# EAGLE design Mini-MLL_Plus_v0.3 (EAGLE 9.6.2)
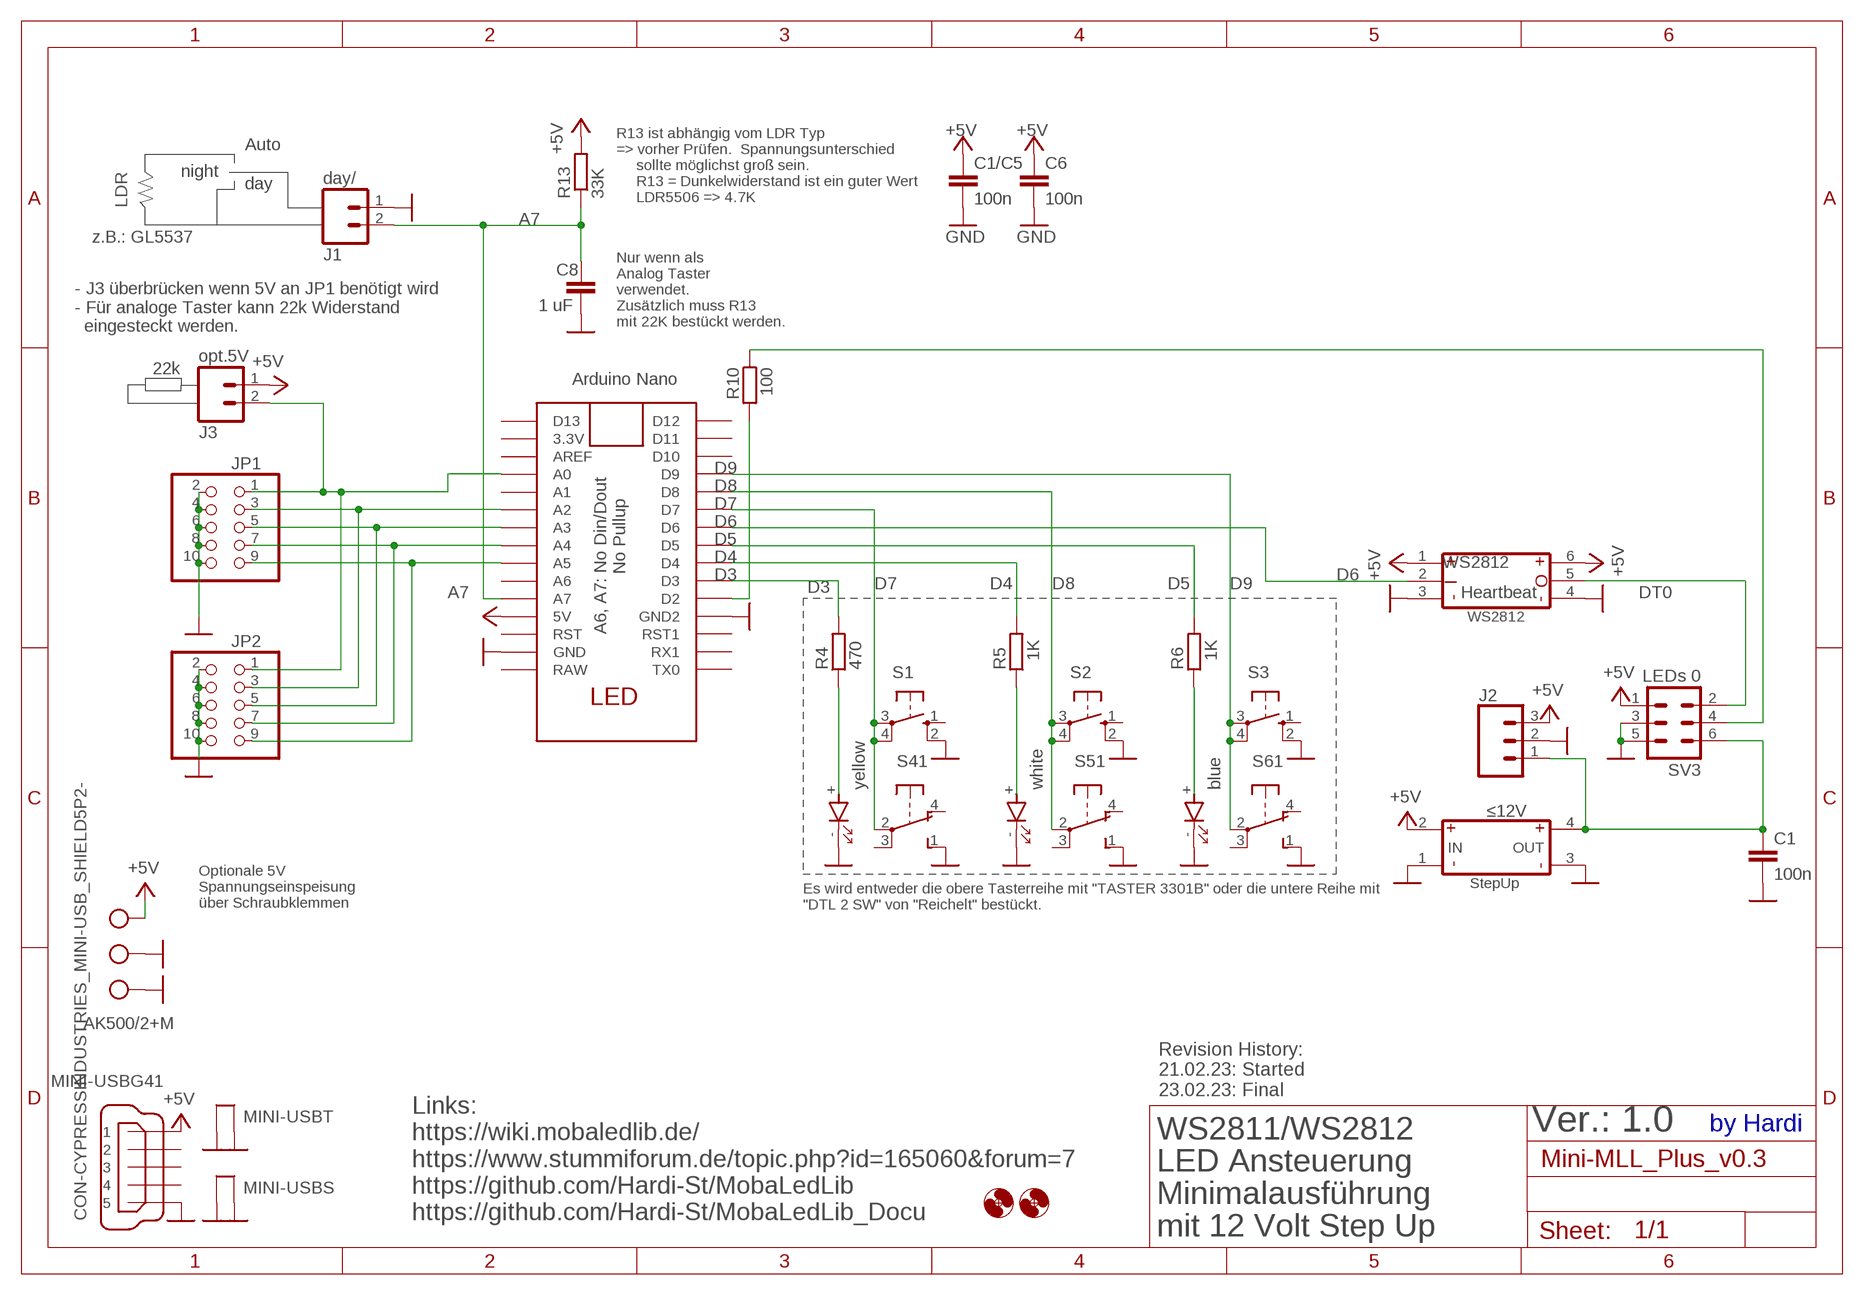
[diagram p0: schematic, sheet 1]

## Parts
C1  100n  C-EU025-025X050  [C025-025X050]
C1/C5  100n  C-EU025-025X050  [C025-025X050]
C6  100n  C-EU025-025X050  [C025-025X050]
C8  1 uF  C-EU025-025X050  [C025-025X050]
H1  MOUNT-HOLE3.0  [3,0]
H2  MOUNT-HOLE3.0  [3,0]
J1  day/  M02PTH  [1X02]
J2  CONN_03  [1X03]
J3  opt.5V  M02PTH  [1X02]
JP1  PINHD-2X5/90  [2X05/90]
JP2  PINHD-2X5CLEAR  [2X05/90_CL]
MINI-USB  CON-CYPRESSINDUSTRIES_MINI-USB_SHIELD5P2-  [MINI_USB_MULTI]
R4  470  R0204/7  [0204/7]
R5  1K  R0204/7  [0204/7]
R6  1K  R0204/7  [0204/7]
R10  100  R-EU_0207/2V  [0207/2V]
R13  33K  R0204/7  [0204/7]
S1  10-XX  [B3F-10XX]
S2  10-XX  [B3F-10XX]
S3  10-XX  [B3F-10XX]
S4  yellow  SRKL  [SRKL]
S5  white  SRKL  [SRKL]
S6  blue  SRKL  [SRKL]
SV3  LEDs 0  ML6  [ML6]
U2  LED NANO  NANO  [NANO]
WS2812  WS2812_BREAKOUT  [WS2812__BREAKOUT]
X4  AK500/2+M  [AK500/2+M]
≤12V  STEP_UP  [MINI_STEP_UP]

## Nets
+5V: C1/C5.1 C6.1 J2.3 J3.1 MINI-USB.1 R13.2 SV3.1 U2.5V WS2812.1(VDD1) WS2812.6(VDD) X4.2 ≤12V.2(VDD_IN)
A7: C8.1 J1.2 R13.1 U2.A7
D3: R4.2 U2.D3
D4: R5.2 U2.D4
D5: R6.2 U2.D5
D6: U2.D6 WS2812.2(DIN)
D7: S1.3(P) S1.4(P1) S4.2(1:P) U2.D7
D8: S2.3(P) S2.4(P1) S5.2(1:P) U2.D8
D9: S3.3(P) S3.4(P1) S6.2(1:P) U2.D9
DT0: SV3.2 WS2812.5(DO)
GND: C1.2 C1/C5.2 C6.2 C8.2 J1.1 J2.2 JP1.2 JP1.4 JP1.6 JP1.8 JP1.10 JP2.2 JP2.4 JP2.6 JP2.8 JP2.10 MINI-USB.5 MINI-USB.M1(S:S1) MINI-USB.M2(S:S2) MINI-USB.M3(T:S1) MINI-USB.M4(T:S2) S1.2(S1) S2.2(S1) S3.2(S1) S4.1(1:S) S4.-(D1:C) S5.1(1:S) S5.-(D1:C) S6.1(1:S) S6.-(D1:C) SV3.3 SV3.5 U2.GND U2.GND1(GND2) WS2812.3(GND1) WS2812.4(GND) X4.1 X4.M ≤12V.1(GND_IN) ≤12V.3(GND_OUT)
N$1: C1.1 J2.1 SV3.6 ≤12V.4(VDD_OUT)
N$2: JP1.3 JP2.3 U2.A2
N$3: JP1.5 JP2.5 U2.A3
N$4: R4.1 S4.+(D1:A)
N$5: JP1.7 JP2.7 U2.A4
N$6: R5.1 S5.+(D1:A)
N$7: R6.1 S6.+(D1:A)
N$8: JP1.9 JP2.9 U2.A5
N$9: J3.2 JP1.1 JP2.1 U2.A0
N$10: R10.2 U2.D2
N$11: R10.1 SV3.4
Unconnected: MINI-USB.2 MINI-USB.3 MINI-USB.4 S1.1(S) S2.1(S) S3.1(S) S4.3(1:P) S4.4(1:O) S5.3(1:P) S5.4(1:O) S6.3(1:P) S6.4(1:O) U2.3.3V U2.A1 U2.A6 U2.AREF U2.D10 U2.D11 U2.D12 U2.D13 U2.RAW U2.RST U2.RST1 U2.RX1 U2.TX0

## Notes on the sheet
- R13 ist abhängig vom LDR Typ
  => vorher Prüfen.  Spannungsunterschied
       sollte möglichst groß sein.
       R13 = Dunkelwiderstand ist ein guter Wert
       LDR5506 => 4.7K
- Auto
- night
- day
- LDR
- z.B.: GL5537
- Nur wenn als
  Analog Taster
  verwendet.
  Zusätzlich muss R13 
  mit 22K bestückt werden.
- - J3 überbrücken wenn 5V an JP1 benötigt wird
  - Für analoge Taster kann 22k Widerstand
    eingesteckt werden.
- 22k
- Heartbeat
- A6, A7: No Din/Dout 
              No Pullup
- LED
- Optionale 5V
  Spannungseinspeisung
  über Schraubklemmen
- Es wird entweder die obere Tasterreihe mit "TASTER 3301B" oder die untere Reihe mit 
  "DTL 2 SW" von "Reichelt" bestückt.
- Revision History:
  21.02.23: Started
  23.02.23: Final
- Ver.: 1.0 | by Hardi
- Links:
  https://wiki.mobaledlib.de/
  https://www.stummiforum.de/topic.php?id=165060&forum=7
  https://github.com/Hardi-St/MobaLedLib
  https://github.com/Hardi-St/MobaLedLib_Docu
- WS2811/WS2812
  LED Ansteuerung
  Minimalausführung
  mit 12 Volt Step Up

## Library data of the parts
C1 C1/C5 C6 C8 = rcl:C-EU: CAPACITOR, European symbol; SPICEPREFIX: C
H1 H2 = holes:MOUNT-HOLE: MOUNTING HOLE with drill center marker
J1 J3 = SparkFun-Connectors:M02: Standard 2-pin 0.1" header. Use with - straight break away headers ( PRT-00116) - right angle break away headers (PRT-00553) - swiss pins (PRT-00743) - machine pins (PRT-00117) - female headers (PRT-00115) Molex polarized connector foot print use with: PRT-08233 with associated crimp pins and housings. 2.54_SCREWTERM for use with PRT-10571. 3.5mm Screw Terminal footprints for PRT-08084 5mm Screw Terminal footprints for use with PRT-08432
J2 = SparkFun-Connectors:CONN_03: Multi connection point. Often used as Generic Header-pin footprint for 0.1 inch spaced/style header connections On any of the 0.1 inch spaced packages, you can populate with these: Break Away Headers - Straight <https://www.sparkfun.com/products/116> (PRT-00116) Break Away Male Headers - Right Angle <https://www.sparkfun.com/products/553> (PRT-00553) Female Headers <https://www.sparkfun.com/products/115> (PRT-00115) Break Away Headers - Machine Pin <https://www.sparkfun.com/products/117> (PRT-00117) Break Away Female Headers - Swiss Machine Pin <https://www.sparkfun.com/products/743> (PRT-00743) Stackable Header - 3 Pin (Female, 0.1") <https://www.sparkfun.com/products/13875> (PRT-13875) For SCREWTERMINALS and SPRING TERMINALS visit here: Screw Terimnals on SparkFun.com <https://www.sparkfun.com/search/results?term=Screw+Terminals> (5mm/3.5mm/2.54mm spacing) This device is also useful as a general connection point to wire up your design to another part of your project. Our various solder wires solder well into these plated through hole pads. Hook-Up Wire - Assortment (Stranded, 22 AWG) <https://www.sparkfun.com/products/11375> (PRT-11375) Hook-Up Wire - Assortment (Solid Core, 22 AWG) <https://www.sparkfun.com/products/11367> (PRT-11367) View the entire wire category on our website here <https://www.sparkfun.com/categories/141> Special notes: Molex polarized connector foot print use with SKU : PRT-08232 with associated crimp pins and housings.
JP1 JP2 = pinhead:PINHD-2X5: PIN HEADER
MINI-USB = Mini-MLL_Plus_v0.2:CON-CYPRESSINDUSTRIES_MINI-USB_SHIELD5P2-: MINI USB-B R/A DIP 5pol. Source: www.cypressindustries.com
R4-R6 R13 = Arduino_fuer_LEDs_DCC_2:R: RESISTOR, European symbol; SPICEMODEL: NONE; SPICEPREFIX: R
R10 = rcl:R-EU_: RESISTOR, European symbol; SPICEPREFIX: R
S1-S3 = switch-omron:10-XX: OMRON SWITCH; MPN: B3F-1000; OC_FARNELL: 176432; OC_NEWARK: 36M3542
S4-S6 = switch-misc:SRKL: SWITCH
SV3 = Arduino_fuer_LEDs_DCC_2:ML6: HARTING; OC_FARNELL: unknown; OC_NEWARK: unknown
U2 = Arduino_fuer_LEDs_DCC_2:NANO: Arduino Nano
WS2812 = Arduino_fuer_LEDs_DCC_2_All:WS2812_BREAKOUT: WS2812 Modul mit Winkelsteckern (by Hardi)
X4 = Arduino_fuer_LEDs_DCC_2:AK500/2+M
≤12V = Arduino_fuer_LEDs_DCC_2_All:STEP_UP

## Board
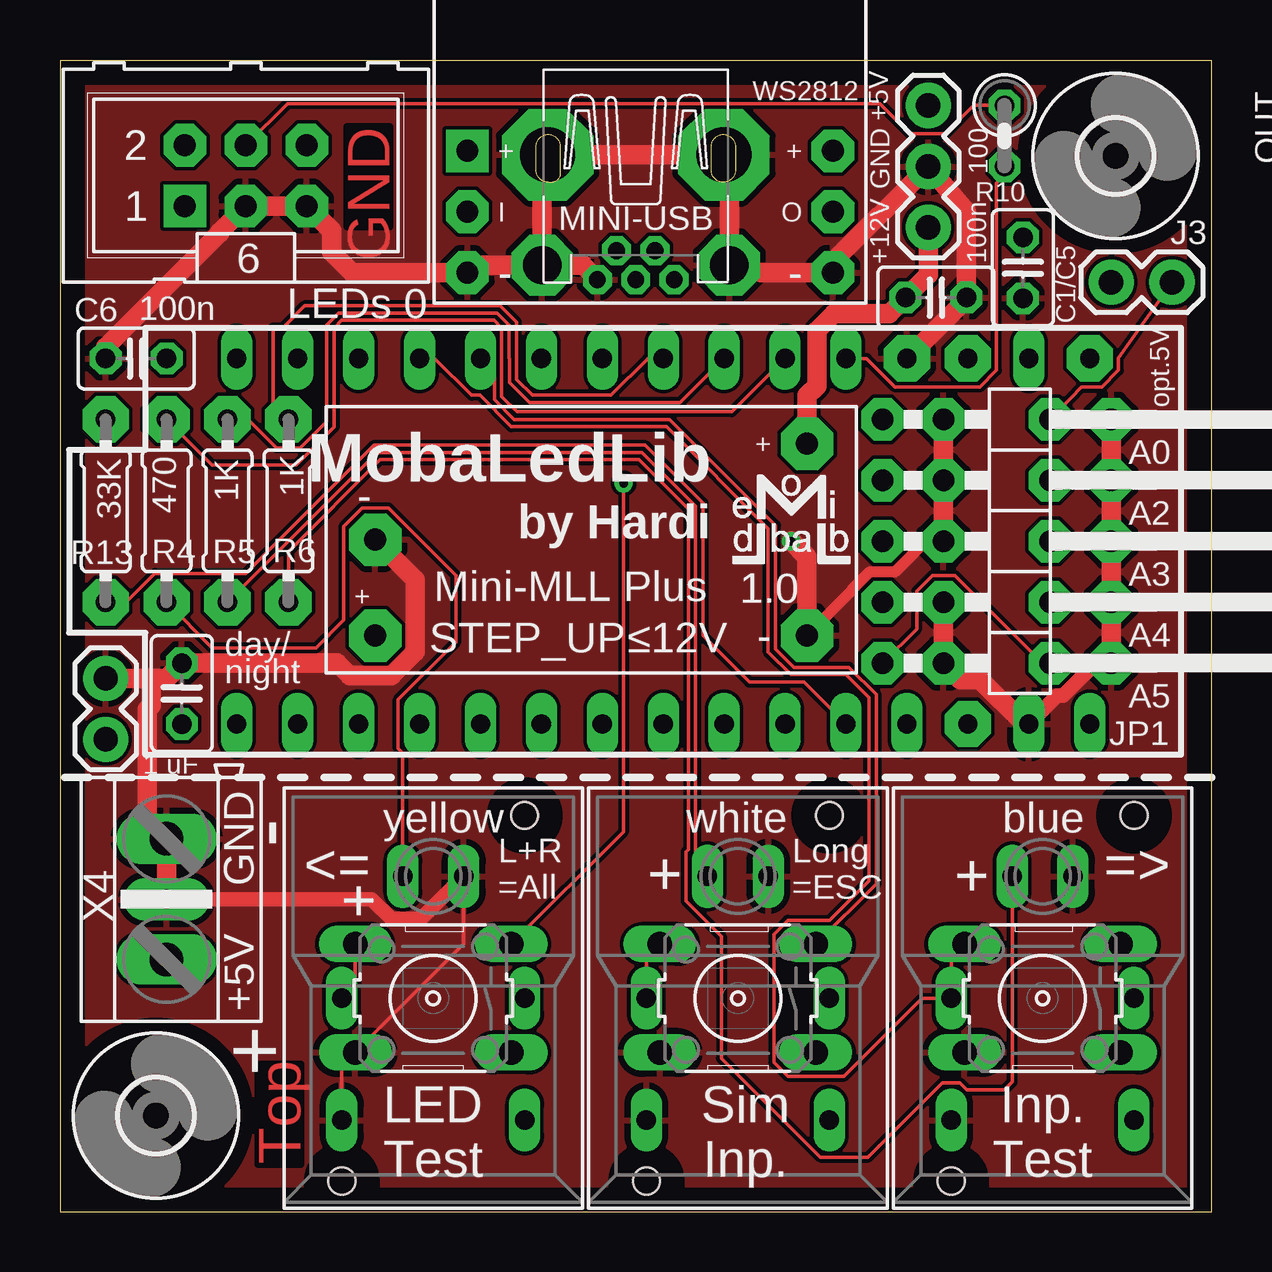
[diagram p1: board, top side]
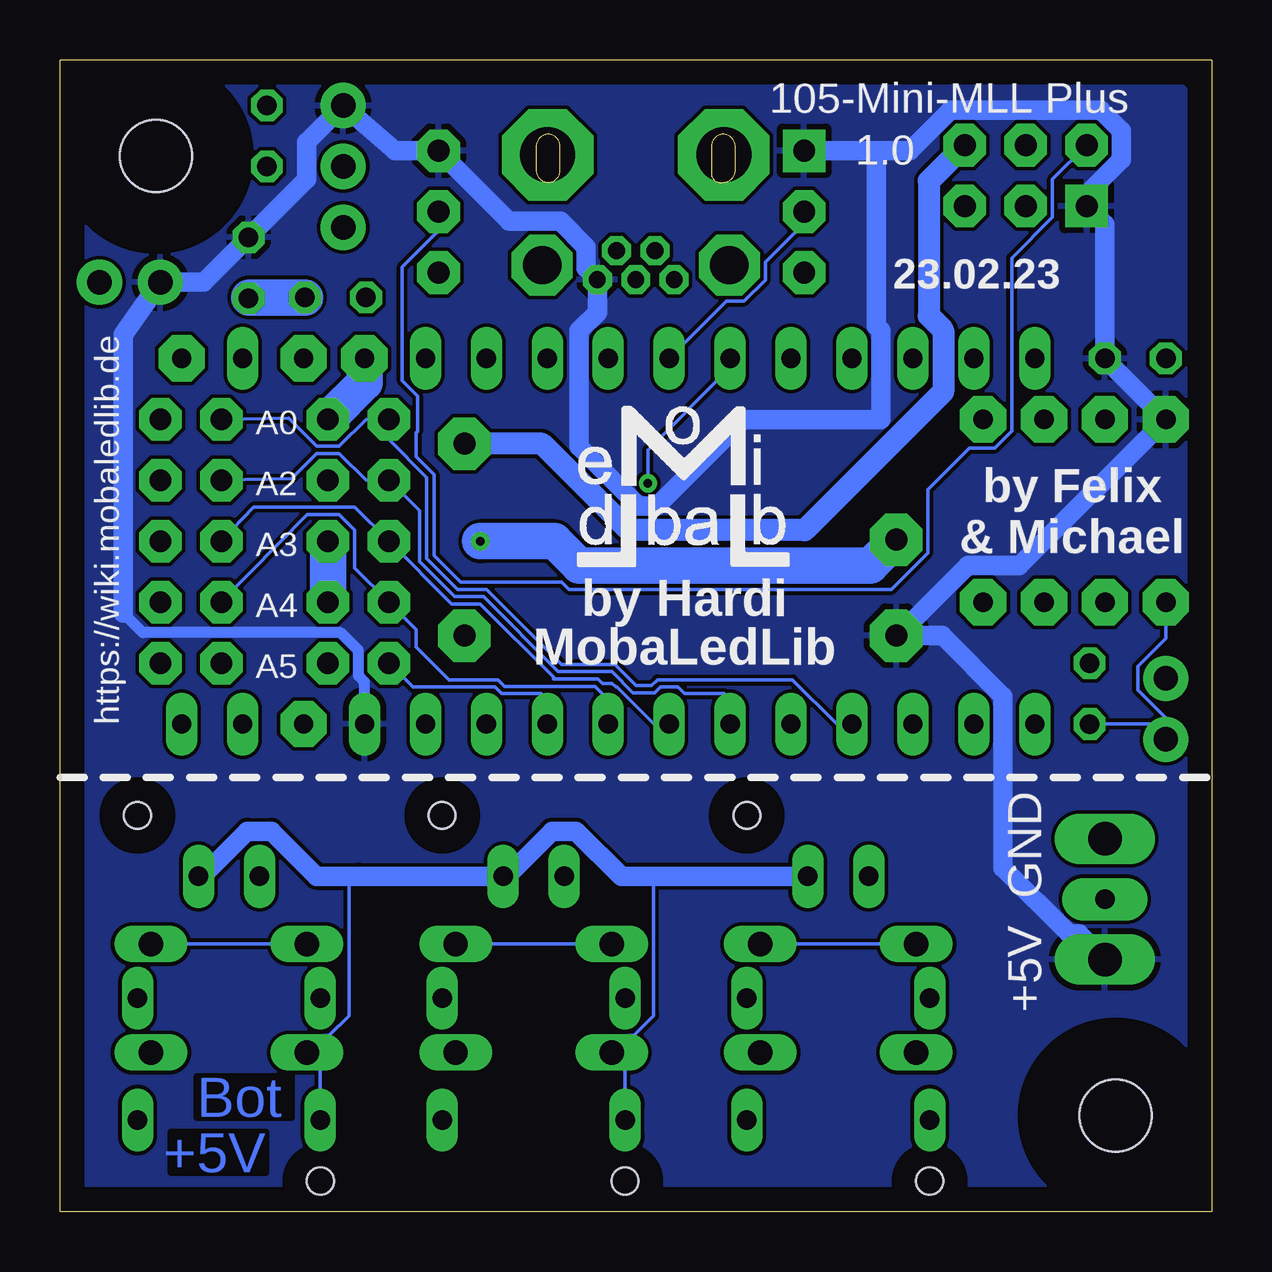
[diagram p2: board, bottom side, seen from below]

Size 48 x 48 mm. Coordinates in mm from the lower left corner, seen from the top.
Outline: 0,48 0,0 48,0 48,48 0,48
Copper layers (1*16): Top 0.035mm / dielectric 1.5mm / Bottom 0.035mm
Design rules "default *": minimum track width 6mil, minimum drill 0.35mm, track to track 6mil, track to pad 6mil, pad to pad 6mil, via to via 6mil, smd to smd 6mil, copper to edge 40mil, drill to drill 6mil, minimum pad ring 10mil, minimum via ring 8mil, stop-mask expansion 4mil, vias tented up to drill 0.5mm, thermal gap 10mil

### Footprints (pad centres in the part's own frame; a part is rotated, then mirrored left to right if it is on the bottom)
C025-025X050 = drill 0.813 octagon: 1 -1.27,0; 2 1.27,0
3,0 = hole 3: 0,0
1X02 = drill 1.016 pad 1.88: 1 0,0; 2 2.54,0
1X03 = drill 1.016 pad 1.88: 1 0,0; 2 2.54,0; 3 5.08,0
2X05/90 = drill 0.9 pad 1.778 octagon: 1 -5.08,-6.35; 2 -5.08,-3.81; 3 -2.54,-6.35; 4 -2.54,-3.81; 5 0,-6.35; 6 0,-3.81; 7 2.54,-6.35; 8 2.54,-3.81; 9 5.08,-6.35; 10 5.08,-3.81
2X05/90_CL = drill 0.9 pad 1.778 octagon: 1 -5.08,-6.35; 2 -5.08,-3.81; 3 -2.54,-6.35; 4 -2.54,-3.81; 5 0,-6.35; 6 0,-3.81; 7 2.54,-6.35; 8 2.54,-3.81; 9 5.08,-6.35; 10 5.08,-3.81
MINI_USB_MULTI = drill 0.7 pad 1.143 octagon: 1 2.825,1.6; 2 1.625,0.8; 3 2.825,0; 4 1.625,-0.8; 5 2.825,-1.6 | drill 2.3 pad 3.81 octagon: M1 -2.375,3.675; M2 -2.375,-3.675 | drill 1.6 pad 2.54 octagon: M3 2.225,3.9; M4 2.225,-3.9
0204/7 = drill 0.813 pad 1.93 octagon: 1 -3.81,0; 2 3.81,0
0207/2V = drill 0.813 octagon: 1 -1.27,0; 2 1.27,0
B3F-10XX = drill 1.016 long: 1 -3.251,2.261; 2 3.251,2.261; 3 -3.251,-2.261; 4 3.251,-2.261
SRKL = drill 0.813 long: 1 -3.81,-5.08; 2 -3.81,0; 3 3.81,0; 4 3.81,-5.08; + -1.27,5.08; - 1.27,5.08 | hole 1.118: 3.81,7.62; -3.81,-7.62
ML6 = drill 0.914 pad 1.778 square: 1 -2.54,-1.27 | drill 0.914 pad 1.778 octagon: 2 -2.54,1.27; 3 0,-1.27; 4 0,1.27; 5 2.54,-1.27; 6 2.54,1.27
NANO = drill 0.8 long: 3.3V -10.16,24.13; 5V -10.16,-1.27; A0 -10.16,19.05; A1 -10.16,16.51; A2 -10.16,13.97; A3 -10.16,11.43; A4 -10.16,8.89; A5 -10.16,6.35; A6 -10.16,3.81; A7 -10.16,1.27; AREF -10.16,21.59; D2 5.08,1.27; D3 5.08,3.81; D4 5.08,6.35; D5 5.08,8.89; D6 5.08,11.43; D7 5.08,13.97; D8 5.08,16.51; D9 5.08,19.05; D10 5.08,21.59; D11 5.08,24.13; D12 5.08,26.67; D13 -10.16,26.67; GND -10.16,-6.35; RAW -10.16,-8.89; RX1 5.08,-6.35 | drill 0.8 pad 1.93 octagon: GND1 5.08,-1.27; RST -10.16,-3.81; RST1 5.08,-3.81; TX0 5.08,-8.89
WS2812__BREAKOUT = drill 0.914 pad 1.778 square: 1 -7.62,2.54 | drill 0.914 pad 1.778 octagon: 2 -7.62,0; 3 -7.62,-2.54; 4 7.62,-2.54; 5 7.62,0; 6 7.62,2.54
AK500/2+M = drill 1.397 long: 1 -2.515,0; 2 2.515,0 | drill 0.813 pad 1.778 long: M 0,0
MINI_STEP_UP = drill 0.914 pad 2.184 octagon: 1 0,4; 2 0,0; 3 18,0; 4 18,8

### Placement (x,y rotation side)
C1  36.51,38.1 0 top
C1/C5  40.14,39.34 270 top
C6  3.17,35.56 180 top
C8  5.08,21.59 90 top
H1  4,4 0 top
H2  44,44 0 top
J1  1.91,22.23 270 top
J2  36.2,41.02 90 top
J3  43.81,38.73 0 top
JP1  40.64,27.94 270 top
JP2  47.62,27.94 270 top
MINI-USB  24,41.67 270 top
R4  4.45,29.21 90 top
R5  6.99,29.21 90 top
R6  9.53,29.21 90 top
R10  39.37,44.84 270 top
R13  1.91,29.21 90 top
S1  15.56,8.89 180 top
S2  28.26,8.89 180 top
S3  40.96,8.89 180 top
S4  15.56,8.89 0 top
S5  28.26,8.89 0 top
S6  40.96,8.89 0 top
SV3  7.75,43.18 0 top
U2  34.04,30.48 90 top
WS2812  24.6,41.67 0 top
X4  4.45,13.02 270 top
≤12V  13.14,24 0 top

### Tracks (layer width: path | path; a pad name or v marks a point on that pad's centre or on a via)
+5V
  Bottom 0.457: U2.5V 35.31,22.08 35.56,22.33 35.56,23.39 36.3,24.13 44.55,24.13 45.35,24.94
  Bottom 0.813: 13.97,44.22 12.57,44.22 10.89,45.9 4.61,45.9 3.76,45.05 3.76,43.85 5.21,42.4 SV3.1 4.45,41.15 C6.1 R13.2 8,26.92 10.16,26.92 13.08,24 | 13.97,44.22 WS2812.1 | 13.97,44.22 13.97,36.91 13.77,36.72 13.77,33.02 19.5,33.02 23.11,29.42 23.88,29.42 26.36,31.89 26.36,36.72 25.6,37.48 MINI-USB.1 26.07,39.32 26.07,40.21 27.14,41.28 29.28,41.28 WS2812.6 34.03,44.22 J2.3 37.72,44.58 37.72,43.03 C1/C5.1 42.01,38.73 J3.1 45.35,36.56 45.35,24.94 | 13.08,24 ≤12V.2 | X4.2 5.51,11.57 5.93,11.57 8.69,14.33 8.69,21.48 11.22,24 13.08,24
  pour Bottom: 0,45.72 2.54,48.26 48.26,48.26 48.26,0 0,0
A7
  Top 0.152: R13.1 2.76,25.4 3.95,26.59 7.75,26.59 13.1,31.95 24.38,31.95 26.8,29.53 26.8,24 28.73,22.07 31.01,22.07 U2.A7
  Bottom 0.152: R13.1 1.91,23.88 3.07,22.71 3.07,21.74 1.91,20.57 J1.2 2.54,20.32 C8.1
D3
  Top 0.152: U2.D3 28,33.34 19.05,33.34 18.41,33.97 18.41,36.83 18.1,37.15 11.75,37.15 11.43,36.83 11.43,32.7 9.84,31.11 6.35,31.11 R4.2
D4
  Top 0.152: U2.D4 25.84,33.72 19.57,33.72 18.73,34.56 18.73,35.56 18.72,35.57 18.72,36.96 18.22,37.45 11.62,37.45 11.11,36.94 11.11,32.92 10.02,31.83 9.03,31.83 7.84,33.02 R5.2
D5
  Top 0.152: R6.2 8.89,33.66 8.89,36.83 9.27,36.83 10.2,37.76 18.35,37.76 19.02,37.08 19.02,36.84 19.04,36.83 19.04,34.69 19.7,34.02 22.97,34.02 24.51,35.56 U2.D5
D6
  Bottom 0.152: WS2812.2 16.98,41.19 18.6,39.56 18.6,38.83 19.48,37.95 20.21,37.95 U2.D6
D7  (via drill 0.35)
  Top 0.152: S1.4 12.31,9.45 S4.2 | S1.3 23.49,15.83 v23.49,30.35 v23.5,30.35
  Bottom 0.152: S1.3 S1.4 | v23.5,30.35 23.5,31.75 20.07,35.18 U2.D7
D8
  Top 0.152: S5.2 24.45,10.59 S2.4 | U2.D8 18.11,34.98 18.11,33.85 18.94,33.02 25.4,33.02 29.82,28.6 29.82,23.46 30.6,22.68 32.89,22.68 34.02,21.55 34.02,13.66 S2.3
  Bottom 0.152: S2.3 S2.4
D9
  Top 0.152: S3.4 37.15,10.59 S6.2 35.93,8.89 32.68,5.64 30.34,5.64 29.76,6.22 29.76,11.56 30.34,12.14 32.07,12.14 33.72,13.79 33.72,21.42 32.76,22.38 30.47,22.38 29.52,23.33 29.52,28.47 25.27,32.72 18.81,32.72 17.5,34.02 17.16,34.02 15.62,35.56 U2.D9
  Bottom 0.152: S3.4 S3.3
DT0
  Bottom 0.152: WS2812.5 32.22,40.89 33.74,39.37 33.74,34.63 33.1,33.99 33.1,32.52 33.15,32.47 33.15,31.46 32.41,30.72 32.41,27.35 31.3,26.25 27.08,26.25 26.77,25.93 13.35,25.93 11.82,27.46 11.82,30.09 10.08,31.83 9.03,31.83 8.33,32.53 8.33,39.74 6.63,41.45 6.63,43.03 SV3.2
GND  (via drill 0.35)
  Top 0.152: S4.1 11.75,6.07 S1.2 16.83,11.15 S4.-
  Top 0.457: ≤12V.3 33.02,25.88 33.02,25.93 33.76,26.67 34.82,26.67 36.09,27.94 JP1.6
  Top 0.61: X4.M 13,13.02 13.82,12.19 15.05,12.19 S4.- | U2.GND 41.58,21.51 41.83,21.51 43.18,22.86 JP2.10
  Top 0.813: C6.2 1.91,36.04 6.66,40.79 6.66,40.82 SV3.3 SV3.5 11.32,40.88 11.32,39.99 12.17,39.13 WS2812.3 17.3,39.45 MINI-USB.M4 | U2.GND1 37.78,38.04 C1.2 37.78,41.69 J2.2 32.22,39.59 WS2812.4 29.21,39.13 MINI-USB.M3 27.9,43.83 MINI-USB.M1 MINI-USB.M2 20.1,43.83 MINI-USB.M4 | U2.GND 40.22,20.32 38.35,22.19 37.5,22.19 JP1.10 JP1.8 | 3.81,22.23 3.81,21.1 3.63,20.92 3.63,16.34 X4.1 X4.M | JP2.10 JP2.8 JP2.6 JP2.4 JP2.2 | JP1.6 JP1.4 JP1.2 | J1.1 3.81,22.23 | 3.81,22.23 4.45,22.23 C8.2 11.56,22.86 12.06,22.35 13.83,22.35 14.8,23.32 14.8,26.35 ≤12V.1 | v30.48,27.94 31.14,27.28 ≤12V.3 | MINI-USB.M4 21.8,39.45 MINI-USB.5
  Bottom 0.152: S5.1 24.45,6.07 S2.2 24.3,7.34 24.08,7.34 23.25,8.17 23.25,13.58 22.86,13.97 | S6.1 37.15,6.07 S3.2 36.99,7.34 36.78,7.34 35.95,8.17 35.95,13.58 35.56,13.97
  Bottom 0.813: S4.- 22.86,13.97 24.6,13.97 26.48,15.85 27.49,15.85 29.37,13.97 S5.- 35.56,13.97 37.3,13.97 39.18,15.85 40.19,15.85 42.07,13.97 S6.- | 40.11,38.1 C1/C5.2
  Bottom 1.524: JP1.6 JP1.8 | JP1.2 36.09,33.76 36.09,33.77 35.31,34.55 U2.GND1 | v30.48,27.94 27.38,27.94 26.36,26.92 14.22,26.92 ≤12V.1 | C1.2 40.11,38.1
  pour Top: 0,48.26 45.72,48.26 48.26,45.72 48.26,0 0,0
N$1
  Top 0.813: ≤12V.4 31.14,34 31.55,34.41 31.55,36.72 32.26,37.43 34.57,37.43 C1.1 36.2,39.05 J2.1
  Bottom 0.914: ≤12V.4 27.91,32 24.3,28.4 16.96,28.4 11.18,34.17 11.18,36.74 11.79,37.34 11.79,42.95 SV3.6
N$2
  Bottom 0.152: U2.A2 20.07,21.34 20.32,21.59 21.97,21.59 22.24,21.86 22.97,21.86 23.21,21.61 24.11,21.61 25,22.5 27.23,22.5 30.35,25.63 31.55,25.63 33.02,27.1 33.02,29.21 JP1.3 35.25,30.48 36.37,31.6 37.29,31.6 38.35,30.54 JP2.3
N$3
  Bottom 0.152: U2.A3 23.24,20.32 24.78,21.86 24.83,21.86 24.98,22.01 25.39,22.01 25.58,22.2 27.43,22.2 27.43,22.28 30.48,25.32 31.67,25.32 JP1.5 35.71,29.36 39.93,29.36 JP2.5
N$4
  Top 0.152: S4.+ 14.29,19.12 14.1,19.3 14.1,21.34 16.51,23.75 16.51,26.5 13.69,29.32 12.6,29.32 11.82,28.55 11.82,24.65 10.67,23.5 6.35,23.5 R4.1
N$5
  Bottom 0.152: U2.A4 25.15,21.34 25.7,21.89 29.47,21.89 29.73,22.16 31.77,22.16 33.15,23.54 33.15,24.26 JP1.7 35.71,26.82 35.71,28.4 36.37,29.06 37.7,29.06 JP2.7
N$6
  Top 0.152: S5.+ 26.5,14.46 26.5,29.4 24.26,31.64 13.23,31.64 R5.1
N$7
  Top 0.152: S6.+ 39.69,5.4 39.37,5.08 37.8,5.08 37.52,5.36 36.78,5.36 33.68,2.26 31.7,2.26 27.57,6.39 27.57,11.47 26.1,12.94 26.1,15 26.19,15.09 26.19,29.27 24.13,31.34 13.35,31.34 9.53,27.51 R6.1
N$8
  Top 0.152: JP2.9 40.89,22.92 37.29,26.52 36.37,26.52 35.71,25.86 35.71,24.28 JP1.9
  Bottom 0.152: JP1.9 33.29,21.86 29.86,21.86 29.59,21.59 27.94,21.59 27.69,21.34 U2.A5
N$9
  Top 0.152: JP2.1 42.57,34.37 43.42,34.37 44.12,35.07 44.12,35.58 J3.2
  Bottom 0.152: U2.A0 15.62,20.32 17.46,22.16 23.1,22.16 23.34,21.92 23.98,21.92 24.87,22.81 27.1,22.81 30.23,25.93 31.42,25.93 32.72,27.23 32.72,30.59 34.29,32.17 JP1.1 35.25,33.02 36.37,31.9 37.29,31.9 38.47,33.08 JP2.1
N$10
  Top 0.152: R10.2 39.35,43.18 39.04,42.87 39.04,35.07 38.34,34.37 34.81,34.37 33.62,35.56 U2.D2
N$11
  Top 0.152: R10.1 38.1,46.11 36.93,44.93 35.43,44.93 34.18,46.18 9.48,46.18 SV3.4

### Text on the board
Top: GND | Top
Bottom: Bot | +5V
bPlace: https://wiki.mobaledlib.de | by Felix / & Michael
tNames: +5V | OUT | GND | +12V | MobaLedLib | A0 | by Hardi | A2 | A3 | Mini-MLL Plus | A4 | night | A5 | +5V GND | - | <= | => | L+R / =All | + | Long / =ESC | + | + | + | LED / Test | Sim / Inp. | Inp. / Test
bNames: 105-Mini-MLL Plus | A0 | A2 | A3 | by Hardi | A4 | MobaLedLib | A5 | +5V GND
Name: 1 LN | 2 LN | 2 SX | 1 SX